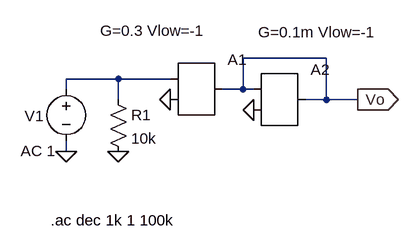
[diagram p0: schematic EJE1_C.asc]
EJE1_C.asc, the LTspice schematic file:
Version 4
SHEET 1 880 680
WIRE 304 48 176 48
WIRE -16 80 -96 80
WIRE 64 80 -16 80
WIRE -96 96 -96 80
WIRE 176 96 176 48
WIRE 176 96 144 96
WIRE 192 96 176 96
WIRE -16 112 -16 80
WIRE 304 112 304 48
WIRE 304 112 272 112
WIRE 352 112 304 112
WIRE -96 192 -96 176
FLAG -96 192 0
FLAG 64 112 0
FLAG -16 192 0
FLAG 192 128 0
FLAG 352 112 Vo
IOPIN 352 112 Out
SYMBOL voltage -96 80 R0
WINDOW 0 -64 57 Left 2
WINDOW 123 -70 111 Left 2
WINDOW 39 0 0 Left 0
SYMATTR InstName V1
SYMATTR Value ""
SYMATTR Value2 AC 1
SYMBOL SpecialFunctions\\ota 96 32 R0
WINDOW 3 -140 -26 Left 2
SYMATTR InstName A1
SYMATTR Value G=0.3 Vlow=-1
SYMBOL res -32 96 R0
SYMATTR InstName R1
SYMATTR Value 10k
SYMBOL SpecialFunctions\\ota 224 48 R0
WINDOW 3 -25 -40 Left 2
SYMATTR InstName A2
SYMATTR Value G=0.1m Vlow=-1
TEXT -120 298 Left 2 !.ac dec 1k 1 100k

The netlist it stands for:
* EJE1_C.asc
V1 N001 0 AC 1
A1 N001 0 0 0 0 0 Vo 0 OTA G=0.3 Vlow=-1
R1 N001 0 10k
A2 Vo 0 0 0 0 0 Vo 0 OTA G=0.1m Vlow=-1
.ac dec 1k 1 100k
.backanno
.end